# EAGLE design gadgiteration_v20 (EAGLE 6.2)
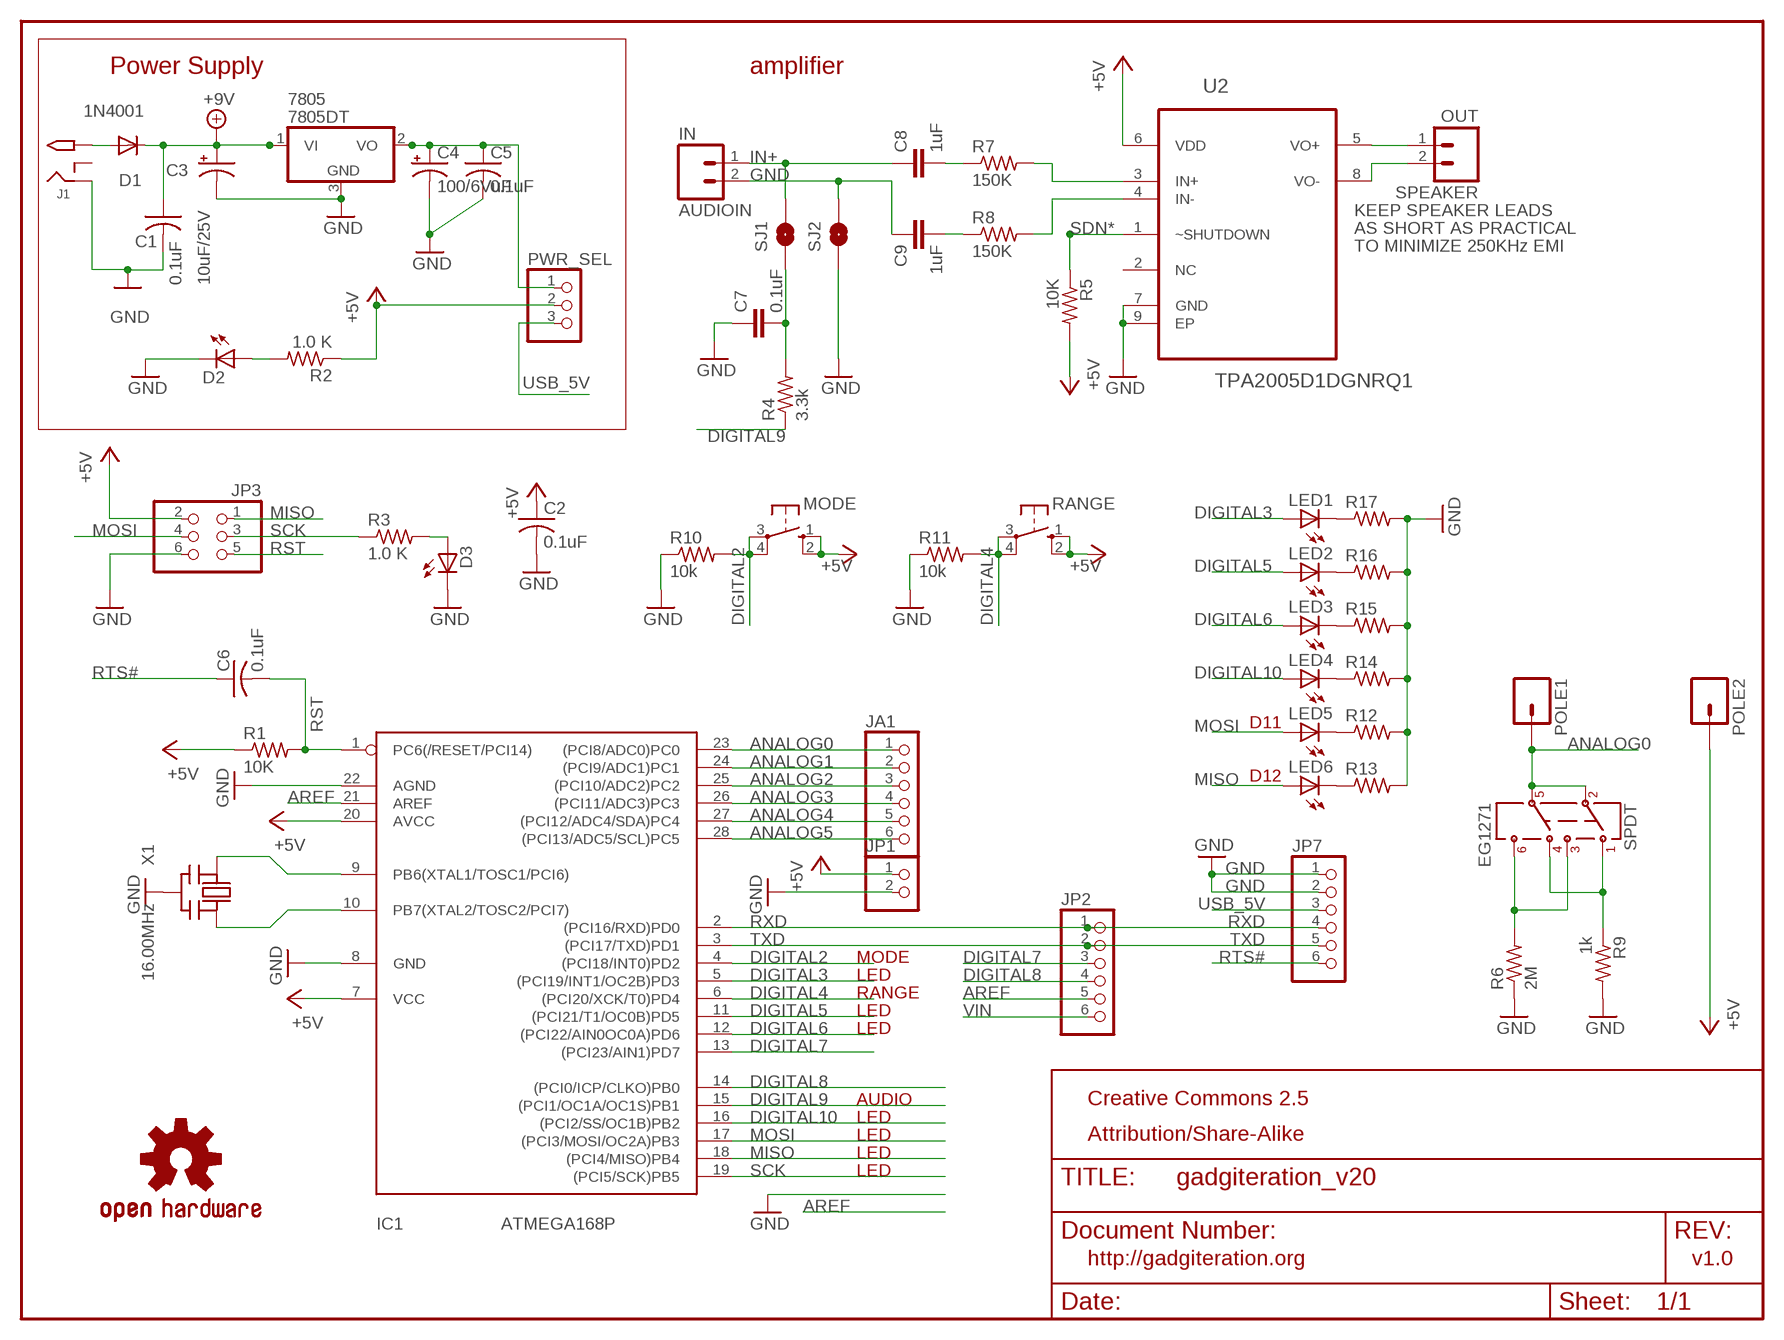
[diagram p0: schematic, sheet 1]

## Parts
7805  7805DT  [TO252]
AUDIOIN  IN  M02PTH  [1X02]
C1  0.1uF  C-US025-025X050  [C025-025X050]
C2  0.1uF  C-US025-025X050  [C025-025X050]
C3  10uF/25V  CPOL-USE2.5-6  [E2,5-6]
C4  100/6VuF  CPOL-USE2.5-6  [E2,5-6]
C5  0.1uF  C-US025-025X050  [C025-025X050]
C6  0.1uF  C-US025-025X050  [C025-025X050]
C7  0.1uF  CAPKIT  [CAP-PTH-SMALL-KIT]
C8  1uF  CAP1206  [1206]
C9  1uF  CAP1206  [1206]
D1  1N4001  DIODEPTH  [DIODE-1N4001]
D2  LED3MM  [LED3MM]
D3  Green  LED3MM  [LED3MM]
IC1  ATMEGA168P  ATMEGA168PROUND  [DIL28/3]
J1  2.1MMJACK  [PJ-102A]
JA1  PINHD-1X6CB  [1X06-CLEANBIG]
JP1  PINHD-1X2CB  [1X02-CB]
JP2  PINHD-1X6CB  [1X06-CLEANBIG]
JP3  PINHD-2X3  [2X03]
JP7  PINHD-1X6CLEAN  [1X06-CLEAN]
LED1  LEDCHIPLED_1206  [CHIPLED_1206]
LED2  LEDCHIPLED_1206  [CHIPLED_1206]
LED3  LEDCHIPLED_1206  [CHIPLED_1206]
LED4  LEDCHIPLED_1206  [CHIPLED_1206]
LED5  LEDCHIPLED_1206  [CHIPLED_1206]
LED6  LEDCHIPLED_1206  [CHIPLED_1206]
LOGO1  OSHW-LOGOM  [OSHW-LOGO-M]
MODE  10-XX  [B3F-10XX]
POLE1  M01PTH_LONGPAD  [1X01_LONGPAD]
POLE2  M01PTH_LONGPAD  [1X01_LONGPAD]
PWR_SEL  PINHD-1X3  [1X03]
R1  10K  R-US_0207/5V  [0207/5V]
R2  1.0 K  R-US_0207/5V  [0207/5V]
R3  1.0 K  R-US_0207/5V  [0207/5V]
R4  3.3k  R-US_M1206  [M1206]
R5  10K  R-US_0204/5  [0204/5]
R6  2M  R-US_0204/5  [0204/5]
R7  150K  R-US_0204/5  [0204/5]
R8  150K  R-US_0204/5  [0204/5]
R9  1k  R-US_0204/5  [0204/5]
R10  10k  R-US_R1206  [R1206]
R11  10k  R-US_R1206  [R1206]
R12  R-US_M0805  [M0805]
R13  R-US_M0805  [M0805]
R14  R-US_M0805  [M0805]
R15  R-US_M0805  [M0805]
R16  R-US_M0805  [M0805]
R17  R-US_M0805  [M0805]
RANGE  10-XX  [B3F-10XX]
SJ1  SOLDERJUMPERTRACE  [SJ_2S-TRACE]
SJ2  SOLDERJUMPERTRACE  [SJ_2S-TRACE]
SPEAKER  OUT  M02PTH3  [1X02_LONGPADS]
U2  TPA2005D1DGNRQ1  [SOP65P490X110-9N]
U$1  AYZ0202  [EG1271]
X1  16.00MHz  CERMOSCILL  [CERM_OSC]

## Nets
+5V: C2.1 IC1.7(VCC) IC1.20(AVCC) JP1.1 JP3.2 MODE.1(S) MODE.2(S1) POLE2.1 PWR_SEL.2 R1.1 R2.1 R5.2 RANGE.1(S) RANGE.2(S1) U2.6(VDD)
ANALOG0: IC1.23((PCI8/ADC0)PC0) JA1.1 POLE1.1 U$1.P$3 U$1.P$4
ANALOG1: IC1.24((PCI9/ADC1)PC1) JA1.2
ANALOG2: IC1.25((PCI10/ADC2)PC2) JA1.3
ANALOG3: IC1.26((PCI11/ADC3)PC3) JA1.4
ANALOG4: IC1.27((PCI12/ADC4/SDA)PC4) JA1.5
ANALOG5: IC1.28((PCI13/ADC5/SCL)PC5) JA1.6
AREF: IC1.21(AREF) JP2.5
DIGITAL2: IC1.4((PCI18/INT0)PD2) MODE.3(P) MODE.4(P1) R10.2
DIGITAL3: IC1.5((PCI19/INT1/OC2B)PD3) LED1.A
DIGITAL4: IC1.6((PCI20/XCK/T0)PD4) R11.2 RANGE.3(P) RANGE.4(P1)
DIGITAL5: IC1.11((PCI21/T1/OC0B)PD5) LED2.A
DIGITAL6: IC1.12((PCI22/AIN0OC0A)PD6) LED3.A
DIGITAL7: IC1.13((PCI23/AIN1)PD7) JP2.3
DIGITAL8: IC1.14((PCI0/ICP/CLKO)PB0) JP2.4
DIGITAL9: IC1.15((PCI1/OC1A/OC1S)PB1) R4.1
DIGITAL10: IC1.16((PCI2/SS/OC1B)PB2) LED4.A
GND: 7805.3(GND) AUDIOIN.2 C1.2 C2.2 C3.- C4.- C5.2 C7.1 C9.1 D2.K(C) D3.K(C) IC1.8(GND) IC1.22(AGND) J1.RING JP1.2 JP3.6 JP7.1 JP7.2 R6.1 R9.2 R10.1 R11.1 R12.2 R13.2 R14.2 R15.2 R16.2 R17.2 SJ2.1 SJ2.2 U2.7(GND) U2.9(EP) X1.P$2(GND)
IN+: AUDIOIN.1 C8.1 SJ1.2
IN+_: C7.2 R4.2 SJ1.1
IN+AMP: R7.2 U2.3(IN+)
IN-AMP: R8.2 U2.4(IN-)
MISO: IC1.18((PCI4/MISO)PB4) JP3.1 LED6.A
MOSI: IC1.17((PCI3/MOSI/OC2A)PB3) JP3.4 LED5.A
N$1: IC1.9(PB6(XTAL1/TOSC1/PCI6)) X1.P$1(IN)
N$2: IC1.10(PB7(XTAL2/TOSC2/PCI7)) X1.P$3(OUT)
N$3: D2.A R2.2
N$4: D3.A R3.2
N$5: LED5.C R12.1
N$6: C8.2 R7.1
N$7: C9.2 R8.1
N$8: R6.2 U$1.P$5 U$1.P$6
N$9: R9.1 U$1.P$1 U$1.P$2
N$10: LED6.C R13.1
N$11: LED4.C R14.1
N$12: LED3.C R15.1
N$13: LED2.C R16.1
N$14: LED1.C R17.1
N$17: D1.A J1.TIP
N$18: SPEAKER.1 U2.5(VO+)
N$19: SPEAKER.2 U2.8(VO-)
N$22: 7805.2(VO) C4.+ C5.1 PWR_SEL.1
RST: C6.2 IC1.1(PC6(/RESET/PCI14)) JP3.5 R1.2
RTS#: C6.1 JP7.6
RXD: IC1.2((PCI16/RXD)PD0) JP2.1 JP7.4
SCK: IC1.19((PCI5/SCK)PB5) JP3.3 R3.1
SDN*: R5.1 U2.1(~SHUTDOWN)
TXD: IC1.3((PCI17/TXD)PD1) JP2.2 JP7.5
USB_5V: JP7.3 PWR_SEL.3
VIN: 7805.1(VI) C1.1 C3.+ D1.C JP2.6 ; supply symbol labelled +9V
Unconnected: J1.RING_SW U2.2(NC)

## Notes on the sheet
- Power Supply | amplifier
- KEEP SPEAKER LEADS
- AS SHORT AS PRACTICAL
- TO MINIMIZE 250KHz EMI
- D11
- D12
- MODE
- LED
- RANGE
- LED
- LED
- AUDIO | Creative Commons 2.5
- LED
- LED | Attribution/Share-Alike
- LED
- LED
- http://gadgiteration.org | v1.0

## Library data of the parts
7805 = linear:78*: Positive VOLTAGE REGULATOR Source: http://cache.national.com/ds/LM/LM78L05.pdf http://www.fairchildsemi.com/ds/LM/LM7805.pdf
AUDIOIN = SparkFun:M02: Header 2 Standard 2-pin 0.1" header. Use with straight break away headers (SKU : PRT-00116), right angle break away headers (PRT-00553), swiss pins (PRT-00743), machine pins (PRT-00117), and female headers (PRT-00115). Molex polarized connector foot print use with SKU : PRT-08233 with associated crimp pins and housings.
C1 C2 C5 C6 = minimidi:C-US: CAPACITOR, American symbol
C3 C4 = minimidi:CPOL-US: POLARIZED CAPACITOR, American symbol
C7 = SparkFun-Capacitors:CAP: Capacitor Standard 0603 ceramic capacitor, and 0.1" leaded capacitor.
C8 C9 = SparkFun:CAP: Capacitor Standard 0603 ceramic capacitor, and 0.1" leaded capacitor.
D1 = SparkFun-DiscreteSemi:DIODE: Diode These are standard reverse protection diodes and small signal diodes. SMA package can handle up to about 1A. SOD-323 can handle about 200mA. What the SOD-323 package when ordering, there are some mfgs out there that are 5-pin packages.
D2 D3 = minimidi:LED: LED
IC1 = avr:ATMEGA168*P: MICROCONTROLLER 16 kBytes FLASH 1 kBytes SRAM 512 Bytes EEPROM USART 8-channel 10 bit ADC
J1 = minimidi:2.1MMJACK
JA1 JP7 = carduino:PINHD-1X6: PIN HEADER
JP1 = carduino:PINHD-1X2: PIN HEADER
JP2 = adafruit:PINHD-1X6: PIN HEADER
JP3 = pinhead-ez:PINHD-2X3: PIN HEADER
LED1-LED6 = led:LED: LED
LOGO1 = SparkFun-Aesthetics:OSHW-LOGO: Open Source Hardware Logo This logo indicates the piece of hardware it is found on incorporates a OSHW license and/or adheres to the definition of open source hardware found here: http://freedomdefined.org/OSHW
MODE RANGE = switch-omron:10-XX: OMRON SWITCH
POLE1 POLE2 = SparkFun-Connectors:M01: Header 1 Standard 1-pin 0.1" header. Use with straight break away headers (SKU : PRT-00116), right angle break away headers (PRT-00553), swiss pins (PRT-00743), machine pins (PRT-00117), and female headers (PRT-00115).
PWR_SEL = pinhead:PINHD-1X3: PIN HEADER
R1 = rcl-ez:R-US_: RESISTOR, American symbol
R2 R3 = minimidi:R-US_: RESISTOR, American symbol
R4-R9 = adafruit:R-US_: RESISTOR, American symbol
R10 R11 = jms:R-US_: RESISTOR, American symbol
R12-R17 = resistor:R-US_: RESISTOR, American symbol
SJ1 SJ2 = SparkFun-Passives:SOLDERJUMPER: Solder Jumper Standard SMD solder jumper. Used to automate production. Two varients : Normally Open and Normally Closed are the same, but have different paste layers. NC will have a large amount of paste and should jumper during reflow.
SPEAKER = SparkFun-Connectors:M02: Header 2 Standard 2-pin 0.1" header. Use with straight break away headers (SKU : PRT-00116), right angle break away headers (PRT-00553), swiss pins (PRT-00743), machine pins (PRT-00117), and female headers (PRT-00115). Molex polarized connector foot print use with SKU : PRT-08233 with associated crimp pins and housings.
U2 = Texas Instruments_By_element14_Batch_1:TPA2005D1DGNRQ1: 1.4-W MONO FILTER-FREE CLASS-D AUDIO POWER AMPLIFIER; MPN: TPA2005D1DGNRQ1; OC_FARNELL: -; OC_NEWARK: 52P6804; PACKAGE: MSOP-8; SUPPLIER: Texas Instruments
U$1 = jms_SparkFun-Electromechanical:AYZ0202: SPDT Slide Switch Simple SMD single-pull double-throw slide switch. Good for less than 350mA power switch, switching UARTs between devices, etc. Spark Fun Electronics SKU : COM-00597
X1 = digg:CERMOSCILL

## Board
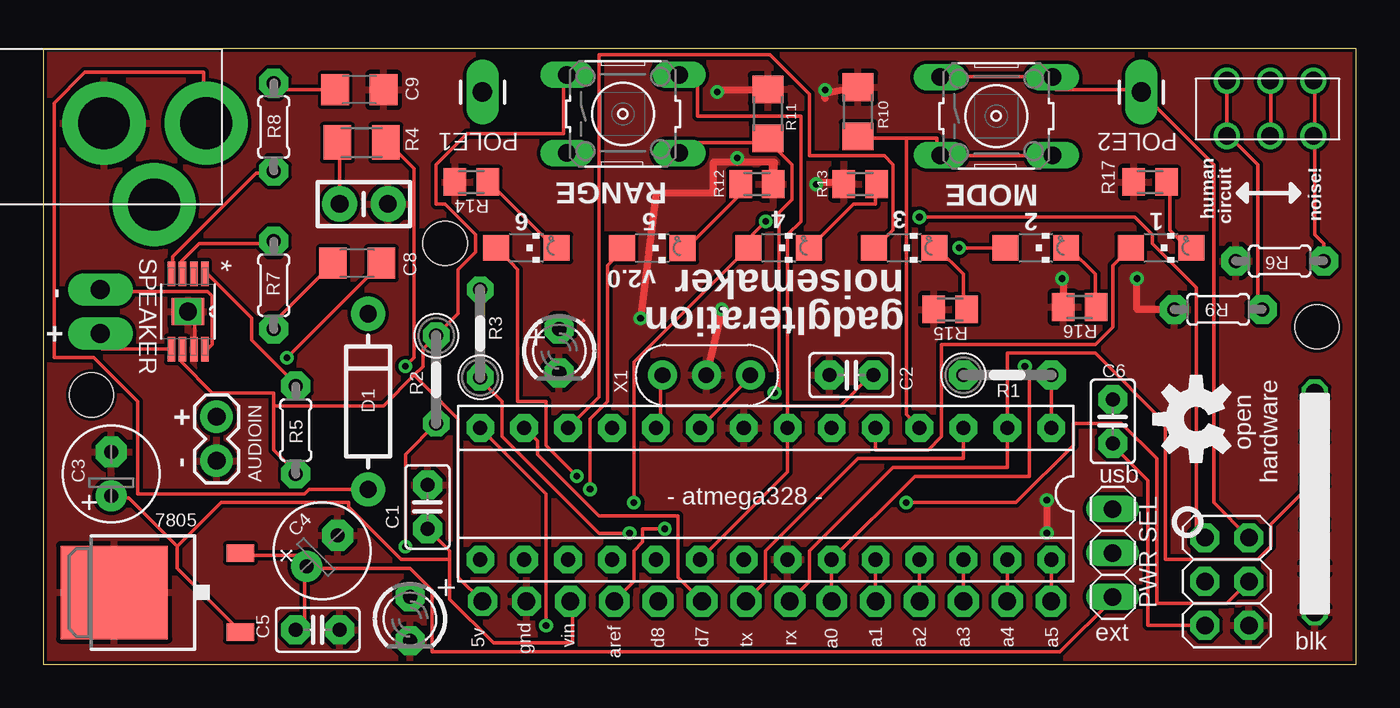
[diagram p1: board, top side]
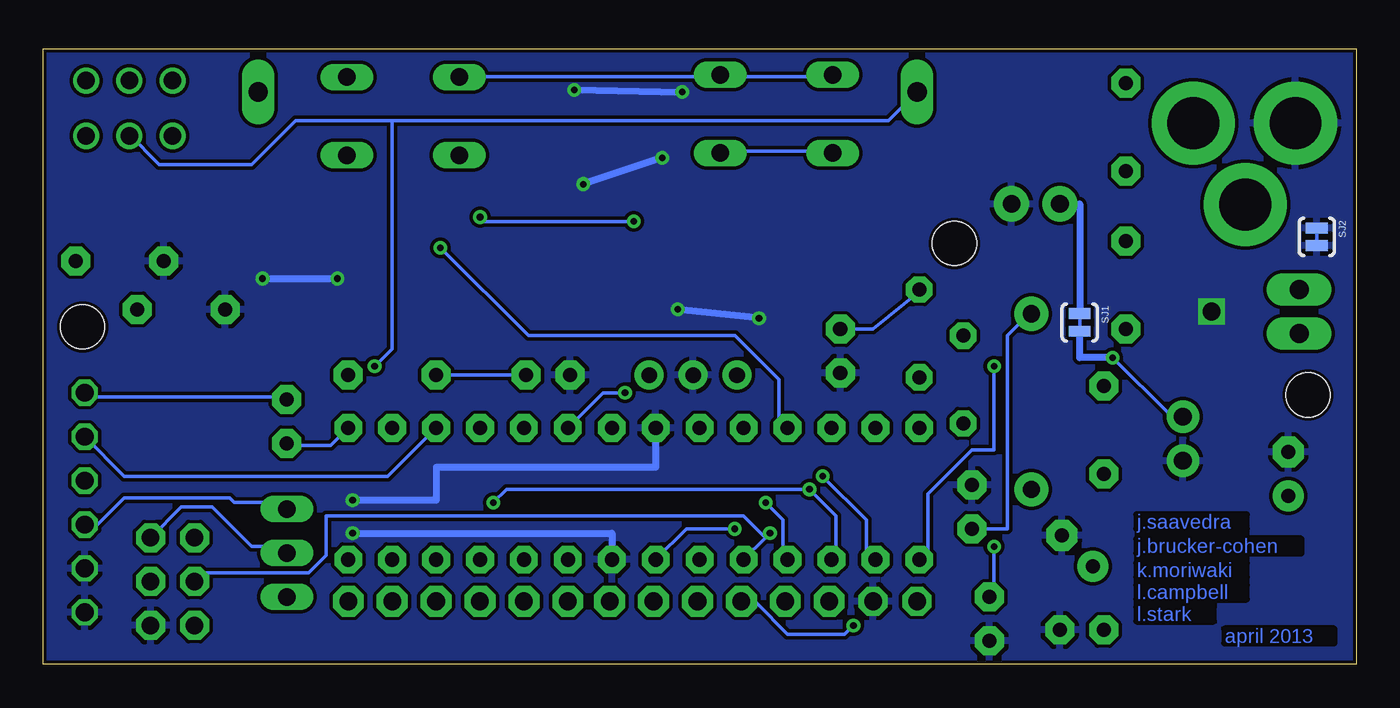
[diagram p2: board, bottom side, seen from below]

Size 75.93 x 35.61 mm. Coordinates in mm from the lower left corner, seen from the top.
Outline: 0,0 75.93,0 75.93,35.61 0,35.61 0,0
Copper layers (1*16): Top 0.035mm / dielectric 1.5mm / Bottom 0.035mm
Design rules: minimum track width 8mil, minimum drill 15mil, track to track 8mil, track to pad 8mil, pad to pad 10mil, via to via 10mil, smd to smd 0mil, copper to edge 8mil, drill to drill 8mil, minimum pad ring 10mil, minimum via ring 8mil, stop-mask expansion 4mil, vias tented up to drill 0mil, thermal gap 10mil
Holes 2.54 mm at 2.79,15.58 73.66,19.52 23.24,24.35

### Footprints (pad centres in the part's own frame; a part is rotated, then mirrored left to right if it is on the bottom)
TO252 = smd 1 x 1.6: 1 -2.28,-4.8; 2 2.28,-4.8 | smd 5.4 x 6.2: 3 0,2.5
1X02 = drill 1.016 pad 1.88: 1 0,0; 2 2.54,0
C025-025X050 = drill 0.813 pad 1.676 octagon: 1 -1.27,0; 2 1.27,0
E2,5-6 = drill 0.813 pad 1.778: + -1.27,0 | drill 0.813 pad 1.778 octagon: - 1.27,0
CAP-PTH-SMALL-KIT = drill 1.016 pad 2.032: 1 -1.397,0; 2 1.397,0
1206 = smd 1.6 x 1.8: 1 -1.4,0; 2 1.4,0
DIODE-1N4001 = drill 1 pad 1.981: A -5.08,0; C 5.08,0
LED3MM = drill 0.813 pad 1.676 octagon: A -1.27,0; K 1.27,0
DIL28/3 = drill 0.813 pad 1.6 octagon: 1 -16.51,-3.81; 2 -13.97,-3.81; 3 -11.43,-3.81; 4 -8.89,-3.81; 5 -6.35,-3.81; 6 -3.81,-3.81; 7 -1.27,-3.81; 8 1.27,-3.81; 9 3.81,-3.81; 10 6.35,-3.81; 11 8.89,-3.81; 12 11.43,-3.81; 13 13.97,-3.81; 14 16.51,-3.81; 15 16.51,3.81; 16 13.97,3.81; 17 11.43,3.81; 18 8.89,3.81; 19 6.35,3.81; 20 3.81,3.81; 21 1.27,3.81; 22 -1.27,3.81; 23 -3.81,3.81; 24 -6.35,3.81; 25 -8.89,3.81; 26 -11.43,3.81; 27 -13.97,3.81; 28 -16.51,3.81
PJ-102A = drill 3 pad 4.8: RING 0.1,-3.39; RING_SW -4.6,-6.29; TIP 0.1,-9.29
1X06-CLEANBIG = drill 1.016 pad 1.778 octagon: 1 -6.35,0; 2 -3.81,0; 3 -1.27,0; 4 1.27,0; 5 3.81,0; 6 6.35,0
1X02-CB = drill 1.016 pad 1.676 octagon: 1 -1.27,0; 2 1.27,0
2X03 = drill 1.016 pad 1.676 octagon: 1 -2.54,-1.27; 2 -2.54,1.27; 3 0,-1.27; 4 0,1.27; 5 2.54,-1.27; 6 2.54,1.27
1X06-CLEAN = drill 1.016 octagon: 1 -6.35,0; 2 -3.81,0; 3 -1.27,0; 4 1.27,0; 5 3.81,0; 6 6.35,0
CHIPLED_1206 = smd 1.5 x 1.5: A 0,-1.75; C 0,1.75
B3F-10XX = drill 1.016 long: 1 -3.251,2.261; 2 3.251,2.261; 3 -3.251,-2.261; 4 3.251,-2.261
1X01_LONGPAD = drill 1.118 pad 1.88 long: 1 0,0
1X03 = drill 1.016 long: 1 -2.54,0; 2 0,0; 3 2.54,0
0207/5V = drill 0.813 pad 1.676 octagon: 1 -2.54,0; 2 2.54,0
0207/5V' = drill 0.813 pad 1.524 octagon: 1 -2.54,0; 2 2.54,0
M1206 = smd 1.6 x 2: 1 -1.4,0; 2 1.4,0
0204/5 = drill 0.813 pad 1.676 octagon: 1 -2.54,0; 2 2.54,0
R1206 = smd 1.6 x 1.803: 1 -1.422,0; 2 1.422,0
M0805 = smd 1.3 x 1.6: 1 -0.95,0; 2 0.95,0
SJ_2S-TRACE = smd 0.635 x 1.27: 1 -0.508,0; 2 0.508,0
1X02_LONGPADS = drill 1.118 pad 1.88 long: 1 0,0; 2 2.54,0
SOP65P490X110-9N = smd 1.422 x 0.432: 1 -2.184,0.965; 2 -2.184,0.33; 3 -2.184,-0.33; 4 -2.184,-0.965; 5 2.184,-0.965; 6 2.184,-0.33; 7 2.184,0.33; 8 2.184,0.965 | smd 1.575 x 1.88: 9 0,0
EG1271 = drill 1: P$1 0,0; P$2 0,3.2; P$3 2.5,3.2; P$4 2.5,0; P$5 5,0; P$6 5,3.2
CERM_OSC = drill 0.9 pad 1.676: P$1 -2.54,0; P$2 0,0; P$3 2.54,0

### Placement (x,y rotation side)
7805  6.6,4.15 90 top
AUDIOIN  10.03,14.31 270 top
C1  22.22,9.11 90 top
C2  46.73,16.73 180 top
C3  3.93,11.01 90 top
C4  16.12,6.57 45 top
C5  15.87,1.99 0 top
C6  61.84,14.06 270 top
C7  18.54,26.63 180 top
C8  18.16,23.2 180 top
C9  18.28,33.24 180 top
D1  18.79,15.2 90 top
D2  21.2,2.63 270 top
D3  29.84,18.12 270 top
IC1  41.78,9.87 180 top
J1  0.12,31.2 90 top
JA1  51.94,3.65 0 top
JP1  26.66,3.65 0 top
JP2  36.83,3.65 180 top
JP3  68.45,4.79 270 top
JP7  73.53,9.36 90 top
LED1  64.64,24.09 270 top
LED2  57.4,24.09 270 top
LED3  49.78,24.09 270 top
LED4  27.93,24.09 270 top
LED5  35.22,24.07 270 top
LED6  42.54,24.09 270 top
LOGO1  66.67,14.19 90 top
MODE  55.11,31.71 0 top
POLE1  25.39,33.11 0 top
POLE2  63.5,33.11 0 top
PWR_SEL  61.84,6.44 90 top
R1  55.75,16.73 0 top
R2  1.0 K  [0207/5V']  22.73,16.47 270 top
R3  1.0 K  [0207/5V']  25.27,19.14 90 top
R4  18.41,30.19 180 top
R5  14.6,13.55 270 top
R6  71.5,23.33 0 top
R7  13.33,21.93 90 top
R8  13.33,31.08 270 top
R9  67.94,20.54 180 top
R10  47.11,31.97 270 top
R11  41.91,31.84 270 top
R12  41.27,27.77 0 top
R13  47.24,27.77 180 top
R14  24.76,27.9 180 top
R15  52.45,20.54 180 top
R16  59.94,20.66 180 top
R17  64,27.9 180 top
RANGE  33.52,31.84 0 top
SJ1  16,19.77 270 bottom
SJ2  2.28,24.73 270 bottom
SPEAKER  3.3,19.14 90 top
U2  8.38,20.41 270 top
U$1  68.45,30.57 0 top
X1  38.35,16.73 180 top

### Tracks (layer width: path | path; a pad name or v marks a point on that pad's centre or on a via)
+5V
  Top 0.203: MODE.1 51.94,34 58.29,34 MODE.2 58.54,33.74 58.54,33.24 63.37,33.24 POLE2.1 67.69,28.92 67.69,9.36 JP3.2 | 13.33,14.95 13.33,12.41 14.6,11.14 R5.2 | 13.33,14.95 13.33,15.71 9.77,15.71 8,17.49 8,18 U2.6 | 21.46,16.73 19.68,14.95 13.33,14.95 | 21.46,16.73 21.97,17.23 21.97,18.25 R2.1 24,20.28 24,22.82 25.01,23.84 25.01,24.85 23.24,26.63 22.73,26.63 22.73,28.92 24.51,30.7 30.09,30.7 30.09,34 RANGE.1 | JP1.1 24,5.04 24,14.19 21.46,16.73 | IC1.20 43.05,11.14 IC1.7 43.05,14.95 | 43.05,14.95 46.1,14.95 47.87,16.73 C2.1 | 43.05,14.95 43.05,24.85 43.81,25.62 43.81,31.71 37.84,31.71 37.84,34 36.95,34 RANGE.2
  Bottom 0.203: JP3.2 67.94,9.11 66.16,9.11 63.88,6.82 62.1,6.82 61.84,6.57 PWR_SEL.2 | RANGE.1 30.35,34 36.7,34 RANGE.2 36.95,34 51.68,34 MODE.1 | C2.1 R1.1
ANALOG0  (via drill 0.38)
  Top 0.203: JA1.1 IC1.23 50.41,10.88 57.02,10.88 57.02,16.98 v56.76,17.23 | U$1.P$4 70.99,30.7 70.99,33.74 U$1.P$3
  Bottom 0.203: POLE1.1 27.05,31.46 55.75,31.46 | 55.75,31.46 61.34,31.46 63.88,28.92 69.21,28.92 70.99,30.7 U$1.P$4 | v56.76,17.23 55.75,18.25 55.75,31.46
ANALOG1
  Top 0.203: JA1.2 IC1.24
ANALOG2
  Top 0.203: JA1.3 IC1.25
ANALOG3
  Top 0.203: JA1.4 IC1.26
ANALOG4
  Top 0.203: JA1.5 IC1.27
ANALOG5
  Top 0.203: JA1.6 IC1.28
AREF  (via drill 0.38)
  Top 0.203: v35.94,7.84 34.67,7.84 34.67,7.07 34.16,6.57 34.16,4.79 JP2.5
  Bottom 0.203: IC1.21 38.73,7.84 v35.94,7.84
DIGITAL2
  Top 0.203: 49.91,30.44 51.68,30.44 51.68,29.68 MODE.3 51.94,29.43 58.29,29.43 MODE.4 | 49.91,30.44 47.11,30.44 R10.2 | IC1.4 49.91,14.44 49.91,30.44
DIGITAL3
  Top 0.203: IC1.5 48.13,12.41 51.18,12.41 51.94,13.17 51.94,18.5 60.83,18.5 61.84,19.52 61.84,23.08 62.86,24.09 LED1.A
DIGITAL4  (via drill 0.38)
  Top 0.203: RANGE.4 36.95,29.68 36.95,30.19 41.78,30.19 R11.2 42.03,30.19 43.3,28.92 43.3,26.89 42.54,26.12 42.54,15.96 v42.29,15.71
  Bottom 0.203: RANGE.3 30.35,29.68 36.7,29.68 RANGE.4 | IC1.6 43.56,15.71 v42.29,15.71
DIGITAL5  (via drill 0.38)
  Top 0.203: v52.95,24.09 LED2.A
  Bottom 0.203: v52.95,24.09 47.87,19.01 35.94,19.01 33.4,16.47 33.4,13.68 IC1.11
DIGITAL6
  Top 0.203: IC1.12 32.13,15.46 32.13,35.27 42.03,35.27 44.32,32.98 44.32,29.43 48.64,29.43 49.14,28.92 49.14,25.11 48.13,24.09 LED3.A
DIGITAL7
  Top 0.203: IC1.13 28.57,12.92 28.57,12.15 32.13,8.6 36.7,8.6 36.7,5.04 JP2.3
DIGITAL8  (via drill 0.38)
  Top 0.203: IC1.14 29.08,9.87 v29.08,2.25
  Bottom 0.203: v29.08,2.25 29.59,1.74 32.89,1.74 34.67,3.52 35.43,3.52 JP2.4
DIGITAL9  (via drill 0.38)
  Top 0.203: v20.95,17.23 21.46,17.74 21.46,28.66 19.93,30.19 R4.1
  Bottom 0.203: v20.95,17.23 20.95,12.41 22.22,12.41 24.76,9.87 24.76,6.06 IC1.15
DIGITAL10  (via drill 0.38)
  Top 0.203: v30.86,10.88 29.08,12.66 29.08,15.2 27.43,15.2 27.43,22.82 26.28,24.09 LED4.A
  Bottom 0.203: v30.86,10.88 28.32,8.34 28.32,6.06 IC1.16
GND  (via drill 0.38, 1.02)
  Top 0.203: U2.9 8.76,20.03 8.76,18.25 U2.7 | 28.57,23.33 28.53,23.33 | 31.11,19.77 31.24,19.88 | 23.74,28.02 23.74,27.9 R14.2 23.74,28.16
  Top 0.406: v58.03,9.49 v58.03,7.58 | R10.1 45.21,33.01 | 45.21,32.73 45.21,33.01 | 45.21,33.01 v45.21,33.24 | v38.98,33.11 39.11,33.24 41.91,33.24 R11.1 | R12.2 42.29,27.77 42.29,27.9 | 42.29,27.9 42.16,27.9 42.16,29.04 38.73,29.04 38.73,27.27 35.43,27.27 v34.54,20.03 | v39.24,20.54 X1.P$2 | 42.29,27.9 42.29,29.04 40.13,29.04 v40.13,29.3 | v44.7,27.77 44.83,27.9 46.29,27.9 R13.2 | R9.2 63.24,20.54 v63.24,22.31 | v58.92,22.31 58.92,22.57 58.99,22.57 R16.2
  Bottom 0.406: IC1.8 40.51,11.39 53.21,11.39 53.21,9.49 v58.03,9.49 | v58.03,7.58 43.05,7.58 IC1.22 | v45.21,33.24 v38.98,33.11 | v34.54,20.03 v39.24,20.54 | v40.13,29.3 v44.7,27.77 | v63.24,22.31 v58.92,22.31
  other vias: 8.38,20.41
  pour Bottom: -4.58,36.67 78.86,36.67 79.12,-2.83 -4.7,-2.83 -4.7,34.63
  pour Top: -7.12,37.55 -6.86,36.16 -6.86,-4.1 77.72,-4.1 77.72,37.94 -6.74,37.94
IN+  (via drill 0.38)
  Top 0.203: v14.09,17.74 19.43,23.08 C8.1
  Bottom 0.203: v14.09,17.74 10.79,14.44 10.03,14.44 AUDIOIN.1
  Bottom 0.406: v14.09,17.74 16,17.74 SJ1.2
IN+_
  Top 0.203: C7.2 17.14,30.19 R4.2
  Bottom 0.406: C7.2 16,26.63 SJ1.1
IN+AMP
  Top 0.203: U2.3 8,22.82 8,23.33 9.01,24.35 13.33,24.35 R7.2
IN-AMP
  Top 0.203: U2.4 7.49,22.82 7.49,23.58 12.31,28.41 13.33,28.41 R8.2
MISO  (via drill 0.38)
  Top 0.203: v34.16,9.36 34.16,17.49 40.76,24.09 LED6.A 41.02,24.09 41.02,24.85 v41.78,25.62 | JP3.1 66.67,7.84 66.67,21.81 64.13,24.35 64.13,24.85 63.11,25.87 v50.67,25.87
  Bottom 0.203: v34.16,9.36 33.14,8.34 33.14,6.06 IC1.18 | v50.67,25.87 50.41,25.62 v41.78,25.62
MOSI  (via drill 0.38)
  Top 0.203: v31.62,10.12 31.62,14.19 32.63,15.2 32.63,23.08 33.4,23.84 LED5.A | JP3.4 68.45,3.52 64.38,3.52 64.38,11.9 62.35,13.93 59.56,13.93 59.56,12.66 56.26,9.36 v49.91,9.36
  Bottom 0.203: IC1.17 30.09,6.06 30.09,8.6 v31.62,10.12 49.14,10.12 v49.91,9.36
N$1
  Top 0.203: IC1.9 40.76,16.47 X1.P$1
N$2
  Top 0.203: IC1.10 35.68,13.93 35.68,16.73 X1.P$3
N$3  (via drill 0.38)
  Top 0.203: R2.2 20.95,12.15 v20.95,6.82
  Bottom 0.203: v20.95,6.82 20.95,4.03 21.2,4.03 D2.A
N$4
  Bottom 0.203: D3.A 27.93,19.39 25.27,21.55 R3.2
N$5
  Top 0.203: LED5.C 37.21,24.09 40.25,27.14 40.25,27.65 R12.1
N$6
  Top 0.203: R7.1 13.33,19.77 16.63,23.08 C8.2
N$7
  Top 0.203: C9.2 13.33,33.24 R8.1
N$8
  Top 0.203: 73.53,30.7 73.53,33.74 U$1.P$6 | 73.53,30.7 73.53,24.85 74.04,24.35 R6.2 | 73.53,30.7 U$1.P$5
N$9
  Top 0.203: U$1.P$2 68.45,30.7 | R9.1 70.23,20.79 70.23,28.92 68.45,30.7 | 68.45,30.7 U$1.P$1
N$10
  Top 0.203: LED6.C 44.32,24.09 46.86,26.63 48.13,26.63 48.13,27.65 R13.1
N$11
  Top 0.203: LED4.C 29.59,24.09 25.78,27.9 R14.1
N$12
  Top 0.203: LED3.C 51.68,24.09 53.21,22.57 53.21,20.54 R15.1
N$13
  Top 0.203: LED2.C 59.3,24.09 60.83,22.57 60.83,20.79 R16.1
N$14
  Top 0.203: LED1.C 66.16,24.09 65.15,25.11 65.15,27.9 R17.1
N$17
  Top 0.203: D1.A 15.36,10.12 15.11,9.87 5.46,9.87 5.46,15.2 2.92,17.74 0.63,17.74 0.63,32.47 2.41,34.25 9.27,34.25 9.27,31.46 J1.TIP
N$18
  Top 0.203: U2.5 7.23,18.25 3.42,18.25 3.42,19.01 SPEAKER.1
N$19
  Top 0.203: U2.8 9.52,18.25 9.77,18.5 9.77,21.3 9.52,21.55 3.42,21.55 SPEAKER.2
N$22
  Top 0.203: 7805.2 11.55,6.31 15.11,6.31 15.11,5.8 C4.+ | PWR_SEL.1 61.84,3.77 58.8,0.72 22.47,0.72 22.47,4.28 21.2,5.55 15.36,5.55 C4.+ | C5.1 15.11,2.5 15.11,5.55 C4.+
RST
  Top 0.203: R1.2 IC1.1 | JP3.5 63.88,2.25 63.88,10.63 61.84,12.66 C6.2
  Bottom 0.203: IC1.1 59.3,12.66 61.84,12.66 C6.2
RTS#
  Bottom 0.203: JP7.6 73.27,15.46 61.84,15.46 C6.1
RXD
  Top 0.203: JP7.4 70.99,8.09 70.99,6.82 70.23,6.06 64.89,6.06 64.89,13.93 60.83,18 55.75,18 IC1.2 55.75,11.39 49.14,11.39 44.32,6.57 44.32,4.79 JP2.1
SCK  (via drill 0.38)
  Top 0.203: v33.9,7.58 32.13,7.58 26.54,13.17 26.54,15.2 25.27,16.47 R3.1
  Bottom 0.203: IC1.19 34.16,7.33 | JP3.3 66.67,5.3 60.57,5.3 59.56,6.31 59.56,8.6 35.43,8.6 34.16,7.33 | 34.16,7.33 v33.9,7.58
SDN*
  Top 0.203: U2.1 9.52,22.57 12.06,20.03 12.06,18.76 14.6,16.22 R5.1
TXD
  Top 0.203: JP2.2 41.78,4.79 41.78,6.57 47.11,11.9 53.21,11.9 IC1.3
  Bottom 0.203: JP7.5 71.24,10.88 56,10.88 IC1.3
USB_5V
  Bottom 0.203: JP7.3 72.77,8.09 71.24,9.61 65.15,9.61 64.89,9.36 62.1,9.36 61.84,9.11 PWR_SEL.3
VIN
  Top 0.203: 7.74,6.82 7.74,5.55 11.3,1.99 7805.1 | 7.74,6.82 4.95,9.61 3.93,9.61 C3.+ | C1.1 23.49,6.57 23.49,6.06 | 23.49,6.06 23.49,3.77 26.03,1.23 30.6,1.23 30.6,3.52 JP2.6 | 7.74,6.82 10.28,9.36 17.65,9.36 17.65,9.11 20.7,6.06 23.49,6.06
  Bottom 0.203: C1.1 20.19,7.84 20.19,19.01 18.92,20.28 D1.C

### Text on the board
Bottom: j.saavedra | j.brucker-cohen | k.moriwaki | l.campbell | l.stark | april 2013
tPlace: 6 | 5 | 4 | 3 | 2 | 1 | human | circuit | noise! | v2.0 | noisemaker | - | gadgIteration | + | R3 | + | C6 | R2 | X1 | C2 | D1 | R1 | + | C3 | usb | open | - | hardware | - atmega328 - | C1 | C4 | + | C5 | PWR SEL | vin | tx | rx | 5v | gnd | d8 | d7 | a0 | a1 | a2 | a3 | a4 | a5 | ext | blk | aref
tNames: MODE